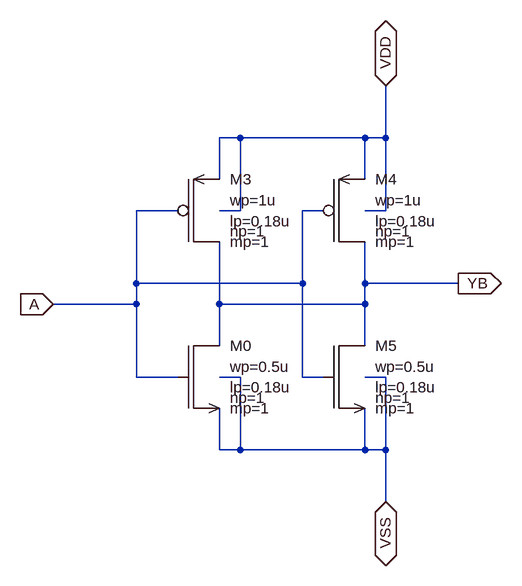
[diagram p0: schematic inv2.asc]
inv2.asc, the LTspice schematic file:
Version 4
SHEET 1 800 832
WIRE 384 176 352 176
WIRE 576 176 384 176
WIRE 608 176 608 96
WIRE 608 176 576 176
WIRE 352 240 352 176
WIRE 576 240 576 176
WIRE 288 288 224 288
WIRE 384 288 384 176
WIRE 384 288 352 288
WIRE 512 288 480 288
WIRE 608 288 608 176
WIRE 608 288 576 288
WIRE 224 400 224 288
WIRE 480 400 480 288
WIRE 480 400 224 400
WIRE 576 400 576 336
WIRE 720 400 576 400
WIRE 224 432 224 400
WIRE 224 432 96 432
WIRE 352 432 352 336
WIRE 576 432 576 400
WIRE 576 432 352 432
WIRE 352 496 352 432
WIRE 576 496 576 432
WIRE 224 544 224 432
WIRE 288 544 224 544
WIRE 384 544 352 544
WIRE 480 544 480 400
WIRE 512 544 480 544
WIRE 608 544 576 544
WIRE 352 656 352 592
WIRE 384 656 384 544
WIRE 384 656 352 656
WIRE 576 656 576 592
WIRE 576 656 384 656
WIRE 608 656 608 544
WIRE 608 656 576 656
WIRE 608 736 608 656
FLAG 720 400 YB
IOPIN 720 400 Out
FLAG 608 736 VSS
IOPIN 608 736 BiDir
FLAG 608 96 VDD
IOPIN 608 96 BiDir
FLAG 96 432 A
IOPIN 96 432 In
SYMBOL ptm180_pmos1p8 512 288 R0
SYMATTR InstName M4
SYMATTR Value wp=1u
SYMATTR Value2 lp=0.18u
SYMBOL ptm180_pmos1p8 288 288 R0
SYMATTR InstName M3
SYMATTR Value wp=1u
SYMATTR Value2 lp=0.18u
SYMBOL ptm180_nmos1p8 512 544 R0
SYMATTR InstName M5
SYMATTR Value wp=0.5u
SYMATTR Value2 lp=0.18u
SYMBOL ptm180_nmos1p8 288 544 R0
SYMATTR InstName M0
SYMATTR Value wp=0.5u
SYMATTR Value2 lp=0.18u

The netlist it stands for:
* inv2.asc
XM4 YB A VDD VDD ptm180_pmos1p8 wp=1u lp=0.18u np=1 mp=1  ; pins ND NG NS NB
XM3 YB A VDD VDD ptm180_pmos1p8 wp=1u lp=0.18u np=1 mp=1  ; pins ND NG NS NB
XM5 YB A VSS VSS ptm180_nmos1p8 wp=0.5u lp=0.18u np=1 mp=1  ; pins ND NG NS NB
XM0 YB A VSS VSS ptm180_nmos1p8 wp=0.5u lp=0.18u np=1 mp=1  ; pins ND NG NS NB
.lib FREE180nm.model
.backanno
.end